# EAGLE design 12 (EAGLE 9.6.2)
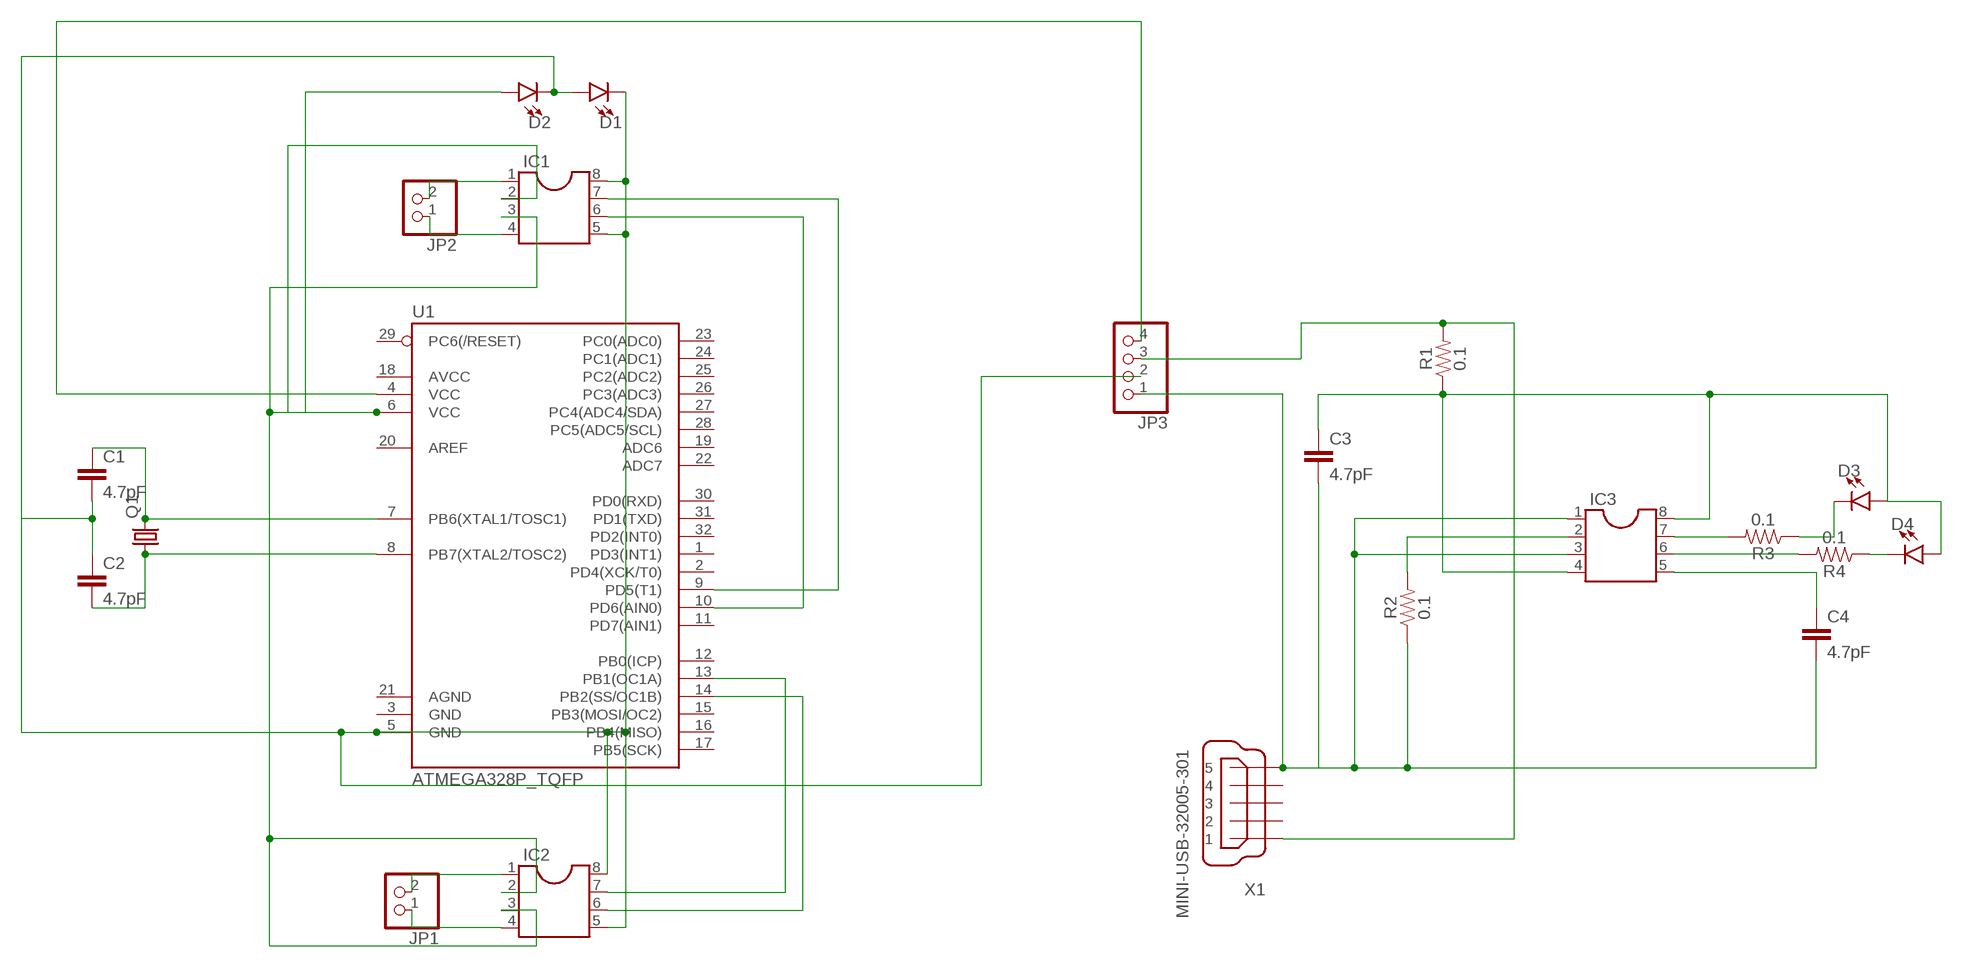
[diagram p0: schematic, sheet 1]

## Parts
C1  4.7pF  4.7PF-0603-50V-5%  [0603]
C2  4.7pF  4.7PF-0603-50V-5%  [0603]
C3  4.7pF  4.7PF-0603-50V-5%  [0603]
C4  4.7pF  4.7PF-0603-50V-5%  [0603]
D1  LED0603  [LED-0603]
D2  LED0603  [LED-0603]
D3  LED0603  [LED-0603]
D4  LED0603  [LED-0603]
IC1  DIL8  [DIL08]
IC2  DIL8  [DIL08]
IC3  DIL8  [DIL08]
JP1  PINHD-1X2  [1X02]
JP2  PINHD-1X2  [1X02]
JP3  PINHD-1X4  [1X04]
Q1  CRYSTALHC49UP  [HC49UP]
R1  0.1  0.1OHM-1210-1/2W-1%  [1210]
R2  0.1  0.1OHM-1210-1/2W-1%  [1210]
R3  0.1  0.1OHM-1210-1/2W-1%  [1210]
R4  0.1  0.1OHM-1210-1/2W-1%  [1210]
U1  ATMEGA328P_TQFP  [TQFP32-08]
X1  MINI-USB-32005-301  [32005-301]

## Nets
N$1: JP3.4 U1.4(VCC)
N$2: D2.A IC1.2 IC1.3 IC2.2 IC2.3 U1.6(VCC)
N$3: IC1.1 JP2.2
N$4: IC1.6 U1.10(PD6(AIN0))
N$5: IC1.7 U1.9(PD5(T1))
N$6: IC2.7 U1.13(PB1(OC1A))
N$7: IC2.6 U1.14(PB2(SS/OC1B))
N$8: C1.1 Q1.2 U1.7(PB6(XTAL1/TOSC1))
N$9: C2.2 Q1.1 U1.8(PB7(XTAL2/TOSC2))
N$10: IC1.4 JP2.1
N$11: IC2.1 JP1.2
N$12: IC2.4 JP1.1
N$13: C3.1 D3.A D4.A IC3.4 IC3.8 R1.1
N$14: IC3.7 R3.2
N$15: IC3.6 R4.2
N$16: D3.C R3.1
N$17: D4.C R4.1
N$18: C4.1 IC3.5
N$19: C1.2 C2.1 D1.A D1.C D2.C IC1.5 IC1.8 IC2.5 IC2.8 JP3.2 U1.5(GND)
N$20: IC3.2 R2.2
N$22: C3.2 C4.2 IC3.1 IC3.3 JP3.1 R2.1 X1.5
N$23: JP3.3 R1.2 X1.1
Unconnected: U1.1(PD3(INT1)) U1.2(PD4(XCK/T0)) U1.3(GND) U1.11(PD7(AIN1)) U1.12(PB0(ICP)) U1.15(PB3(MOSI/OC2)) U1.16(PB4(MISO)) U1.17(PB5(SCK)) U1.18(AVCC) U1.19(ADC6) U1.20(AREF) U1.21(AGND) U1.22(ADC7) U1.23(PC0(ADC0)) U1.24(PC1(ADC1)) U1.25(PC2(ADC2)) U1.26(PC3(ADC3)) U1.27(PC4(ADC4/SDA)) U1.28(PC5(ADC5/SCL)) U1.29(PC6(/RESET)) U1.30(PD0(RXD)) U1.31(PD1(TXD)) U1.32(PD2(INT0)) X1.2 X1.3 X1.4

## Library data of the parts
C1-C4 = SparkFun-Capacitors:4.7PF: 4.7pF ceramic capacitors A capacitor is a passive two-terminal electrical component used to store electrical energy temporarily in an electric field.; PROD_ID: CAP-07880
D1-D4 = SparkFun-LED:LED: LED (Generic) Standard schematic elements and footprints for 5mm, 3mm, 1206, and 0603 sized LEDs. Generic LEDs with no color specified.
IC1-IC3 = ic-package:DIL8: Dual In Line / Socket
JP1 JP2 = pinhead:PINHD-1X2: PIN HEADER
JP3 = pinhead:PINHD-1X4: PIN HEADER
Q1 = crystal:CRYSTAL: CRYSTAL; OC_FARNELL: unknown; OC_NEWARK: unknown
R1-R4 = SparkFun-Resistors:0.1OHM: 0.1Ω resistor A resistor is a passive two-terminal electrical component that implements electrical resistance as a circuit element. Resistors act to reduce current flow, and, at the same time, act to lower voltage levels within circuits. - Wikipedia; PROD_ID: RES-12374
U1 = SparkFun-IC-Microcontroller:ATMEGA328P_TQFP: Popular 328P in QFP Storefront component: ATmega328 - TQFP <https://www.sparkfun.com/products/13448> (COM-13448) Datasheet <http://www.sparkfun.com/datasheets/Components/SMD/ATMega328.pdf> SparkFun Products SparkFun RedBoard - Programmed with Arduino <https://www.sparkfun.com/products/12757> (DEV-12757) Arduino Pro Mini 328 - 5V/16MHz <https://www.sparkfun.com/products/11113> (DEV-11113) Arduino Pro Mini 328 - 3.3V/8MHz <https://www.sparkfun.com/products/11114> (DEV-11114) SparkFun OpenLog <https://www.sparkfun.com/products/13712> (DEV-13712) SparkFun MicroView - OLED Arduino Module <https://www.sparkfun.com/products/12923> (DEV-12923) SparkFun Digital Sandbox <https://www.sparkfun.com/products/12651> (DEV-12651) SparkFun PicoBoard <https://www.sparkfun.com/products/11888> (WIG-11888) Arduino Fio <https://www.sparkfun.com/products/10116> (DEV-10116) LilyPad Arduino 328 Main Board <https://www.sparkfun.com/products/13342> (DEV-13342) SparkFun RedStick <https://www.sparkfun.com/products/13741> (DEV-13741) LilyPad MP3 <https://www.sparkfun.com/products/11013> (DEV-11013) LilyPad Arduino SimpleSnap <https://www.sparkfun.com/products/10941> (DEV-10941) SparkFun Stepoko <https://www.sparkfun.com/products/13899> (ROB-13899) SparkFun Geiger Counter <https://www.sparkfun.com/products/11345> (SEN-11345) SparkFun EL Sequencer <https://www.sparkfun.com/products/12781> (COM-12781) Arduino Pro 328 - 5V/16MHz <https://www.sparkfun.com/products/10915> (DEV-10915) CryptoCape <https://www.sparkfun.com/products/12773> (DEV-12773) SparkFun IR Thermometer Evaluation Board - MLX90614 <https://www.sparkfun.com/products/10740> (SEN-10740) SparkFun RedBot Mainboard <https://www.sparkfun.com/products/12097> (ROB-12097) Arduino Pro 328 - 3.3V/8MHz <https://www.sparkfun.com/products/10914> (DEV-10914) SparkFun Block for Intel® Edison - Arduino <https://www.sparkfun.com/products/13036> (DEV-13036) SparkFun Simon Says - Surface Mount Soldering Kit <https://www.sparkfun.com/products/10935> (KIT-10935) SparkFun 7-Segment Serial Display - Red <https://www.sparkfun.com/products/11441> (COM-11441) SparkFun 7-Segment Serial Display - White <https://www.sparkfun.com/products/11629> (COM-11629) SparkFun 7-Segment Serial Display - Yellow <https://www.sparkfun.com/products/11443> (COM-11443) SparkFun 7-Segment Serial Display - Kelly Green <https://www.sparkfun.com/products/11440> (COM-11440) SparkFun 7-Segment Serial Display - Blue <https://www.sparkfun.com/products/11442> (COM-11442) SparkFun OpenSegment Serial Display - 20mm (Blue) <https://www.sparkfun.com/products/11647> (COM-11647) SparkFun OpenSegment Serial Display - 20mm (Green) <https://www.sparkfun.com/products/11646> (COM-11646) SparkFun OpenSegment Serial Display - 20mm (White) <https://www.sparkfun.com/products/11648> (COM-11648) SparkFun OpenSegment Serial Display - 20mm (Red) <https://www.sparkfun.com/products/11644> (COM-11644) SparkFun OpenSegment Serial Display - 20mm (Yellow) <https://www.sparkfun.com/products/11645> (COM-11645) SparkFun OpenSegment Shield <https://www.sparkfun.com/products/13190> (DEV-13190); PROD_ID: IC-09069
X1 = con-cypressindustries:MINI-USB-: MINI USB-B Conector Source: www.cypressindustries.com; OC_FARNELL: unknown; OC_NEWARK: unknown

## Board
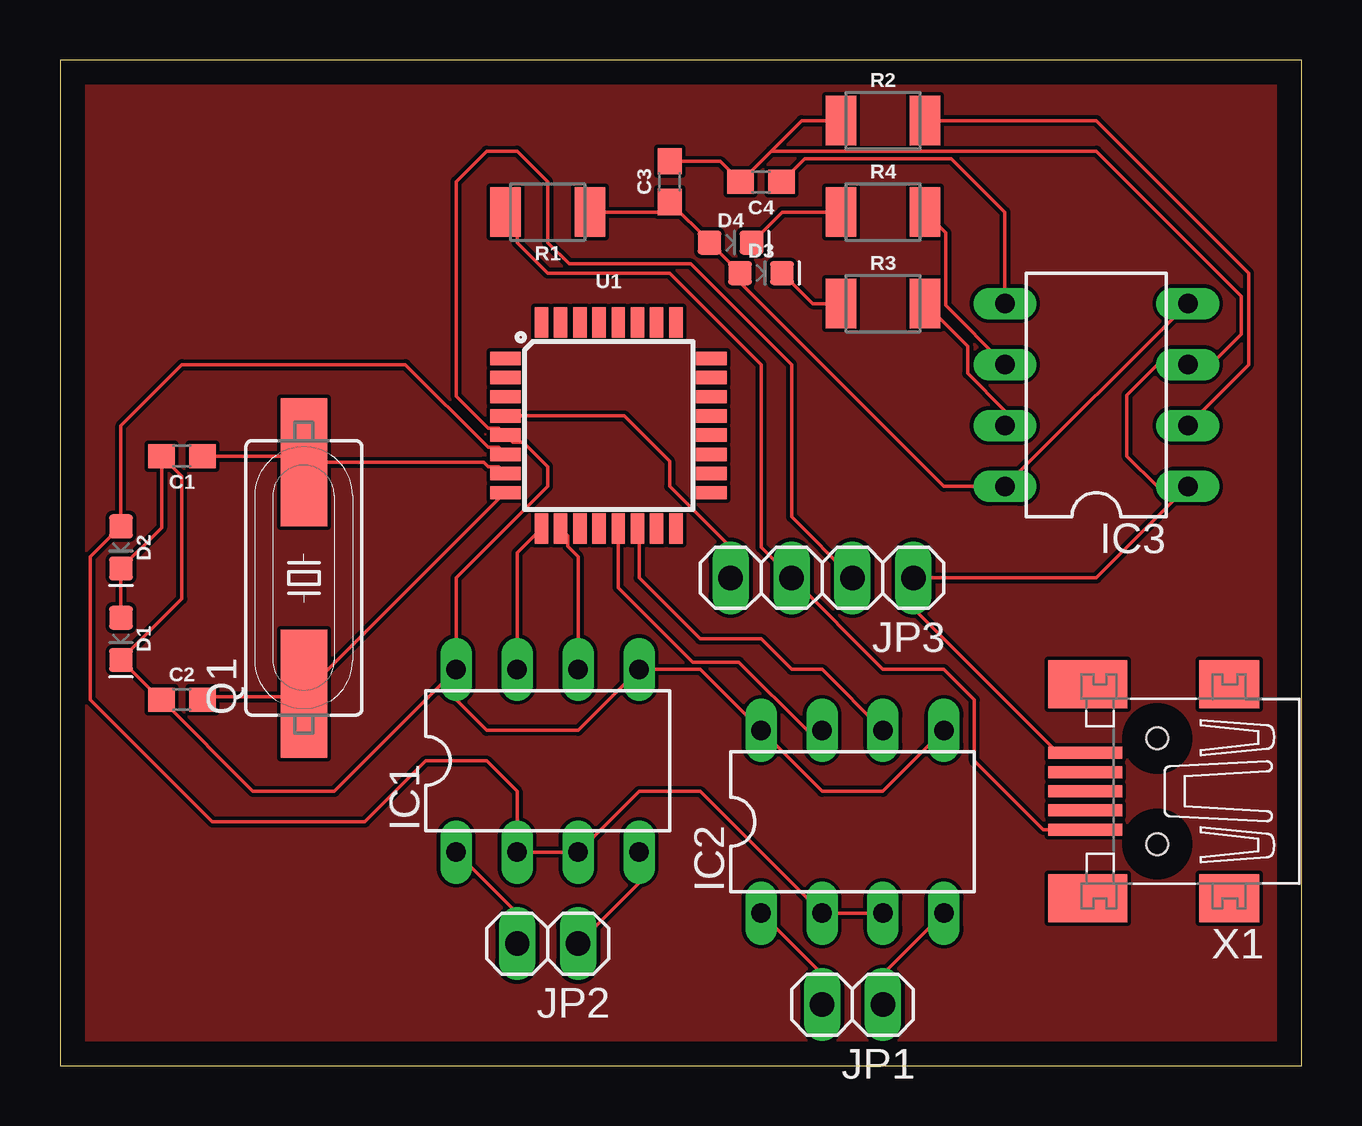
[diagram p1: board, top side]

Size 51.74 x 41.9 mm. Coordinates in mm from the lower left corner, seen from the top.
Outline: 0,0 51.74,0 51.74,41.9 0,41.9 0,0
Copper layers (1*16): Top 0.035mm / dielectric 1.5mm / Bottom 0.035mm
Design rules "default": minimum track width 6mil, minimum drill 0.35mm, track to track 6mil, track to pad 6mil, pad to pad 6mil, via to via 6mil, smd to smd 6mil, copper to edge 40mil, drill to drill 6mil, minimum pad ring 10mil, minimum via ring 8mil, stop-mask expansion 4mil, vias tented up to drill 0mil, thermal gap 10mil

### Footprints (pad centres in the part's own frame; a part is rotated, then mirrored left to right if it is on the bottom)
0603 = smd 1.1 x 1: 1 -0.85,0; 2 0.85,0
LED-0603 = smd 1 x 1: A -0.877,0; C 0.877,0
DIL08 = drill 0.813 long: 1 -3.81,-3.81; 2 -1.27,-3.81; 3 1.27,-3.81; 4 3.81,-3.81; 5 3.81,3.81; 6 1.27,3.81; 7 -1.27,3.81; 8 -3.81,3.81
1X02 = drill 1.016 long: 1 -1.27,0; 2 1.27,0
1X04 = drill 1.016 long: 1 -3.81,0; 2 -1.27,0; 3 1.27,0; 4 3.81,0
HC49UP = smd 5.334 x 1.93: 1 -4.826,0; 2 4.826,0
1210 = smd 1.27 x 2.06: 1 -1.755,0; 2 1.755,0
TQFP32-08 = smd 1.27 x 0.559: 1 -4.293,2.8; 2 -4.293,2; 3 -4.293,1.2; 4 -4.293,0.4; 5 -4.293,-0.4; 6 -4.293,-1.2; 7 -4.293,-2; 8 -4.293,-2.8; 17 4.293,-2.8; 18 4.293,-2; 19 4.293,-1.2; 20 4.293,-0.4; 21 4.293,0.4; 22 4.293,1.2; 23 4.293,2; 24 4.293,2.8 | smd 0.559 x 1.27: 9 -2.8,-4.293; 10 -2,-4.293; 11 -1.2,-4.293; 12 -0.4,-4.293; 13 0.4,-4.293; 14 1.2,-4.293; 15 2,-4.293; 16 2.8,-4.293; 25 2.8,4.293; 26 2,4.293; 27 1.2,4.293; 28 0.4,4.293; 29 -0.4,4.293; 30 -1.2,4.293; 31 -2,4.293; 32 -2.8,4.293
32005-301 = smd 3.1 x 0.5: 1 3,1.6; 2 3,0.8; 3 3,0; 4 3,-0.8; 5 3,-1.6 | smd 2.5 x 2: M1 -3,-4.45; M2 -3,4.45 | smd 3.3 x 2: M3 2.9,4.45; M4 2.9,-4.45 | hole 0.9: 0,2.2; 0,-2.2

### Placement (x,y rotation side)
C1  5.08,25.4 180 top
C2  5.08,15.24 0 top
C3  25.4,36.83 90 top
C4  29.21,36.83 180 top
D1  2.54,17.78 270 top
D2  2.54,21.59 270 top
D3  29.21,33.02 0 top
D4  27.94,34.29 0 top
IC1  20.32,12.7 0 top
IC2  33.02,10.16 0 top
IC3  43.18,27.94 90 top
JP1  33.02,2.54 180 top
JP2  20.32,5.08 180 top
JP3  31.75,20.32 180 top
Q1  10.16,20.32 90 top
R1  20.32,35.56 180 top
R2  34.29,39.37 0 top
R3  34.29,31.75 0 top
R4  34.29,35.56 0 top
U1  22.86,26.67 0 top
X1  45.72,11.43 180 top

### Tracks (layer width: path | path; a pad name or v marks a point on that pad's centre or on a via)
GND
  pour Top: 0,41.91 52.07,41.91 52.07,0 0,0
N$1
  Top 0.152: U1.4 23.52,27.07 25.4,25.18 25.4,24.13 27.94,21.59 JP3.4
N$2
  Top 0.152: D2.A 2.74,22.66 | U1.6 18.27,25.76 17.84,25.76 14.39,29.21 5.08,29.21 2.54,26.67 D2.A | D2.A 1.27,21.2 1.27,15.24 6.35,10.16 12.7,10.16 15.24,12.7 17.78,12.7 19.05,11.43 IC1.2 IC1.3 24.13,11.43 26.67,11.43 IC2.2 IC2.3
N$3
  Top 0.152: IC1.1 19.05,6.35 JP2.2
N$4
  Top 0.152: U1.10 21.15,22.08 21.15,21.65 21.59,21.21 IC1.6
N$5
  Top 0.152: IC1.7 19.05,21.37 U1.9
N$6
  Top 0.152: U1.13 23.26,19.92 26.37,16.82 28.28,16.82 31.13,13.97 IC2.7
N$7
  Top 0.152: U1.14 24.13,22.31 24.13,20.32 26.67,17.78 29.21,17.78 30.48,16.51 31.75,16.51 IC2.6
N$8
  Top 0.152: U1.7 18.27,24.96 17.84,24.96 17.65,25.15 Q1.2 9.91,25.4 C1.1
N$9
  Top 0.152: 10.03,15.37 Q1.1 18.54,23.87 U1.8 | 10.03,15.37 9.91,15.24 | C2.2 6.06,15.37 10.03,15.37
N$10
  Top 0.152: JP2.1 24.13,7.62 IC1.4
N$11
  Top 0.152: IC2.1 31.75,3.81 JP1.2
N$12
  Top 0.152: JP1.1 34.29,3.81 IC2.4
N$13
  Top 0.152: D3.A 28.14,33.22 | 28.14,33.22 D4.A 27.06,34.32 C3.1 24.98,35.56 R1.1 | IC3.4 IC3.8 36.83,24.13 28.14,32.82 28.14,33.22
N$14
  Top 0.152: 36.05,32.23 R3.2 37.82,29.97 37.82,28.84 39.37,27.29 IC3.7
N$15
  Top 0.152: R4.2 36.91,34.7 36.91,31.67 IC3.6
N$16
  Top 0.152: D3.C 31.36,31.75 R3.1
N$17
  Top 0.152: R4.1 30.09,35.56 D4.C
N$18
  Top 0.152: C4.1 31.02,37.8 37.13,37.8 39.37,35.56 IC3.5
N$19
  Top 0.152: D1.C 2.93,16.51 | IC1.8 16.51,20.32 20.32,24.13 20.32,24.96 19.3,25.98 18.86,25.98 U1.5 18.27,26.56 17.84,26.56 16.51,27.89 16.51,36.83 17.78,38.1 19.05,38.1 20.32,36.83 20.32,34.29 21.21,33.4 26.29,33.4 30.48,29.21 30.48,22.86 JP3.2 | IC1.8 16.51,15.24 17.78,13.97 21.59,13.97 IC1.5 26.67,16.51 IC2.8 31.75,11.43 34.29,11.43 IC2.5 | IC1.8 11.43,11.43 8.04,11.43 C2.1 4.2,15.24 D1.C | D1.A D2.C 4.23,22.4 C1.2 5.08,24.55 5.08,19.44 D1.C | D1.C 2.34,17.1
N$20
  Top 0.152: IC3.2 49.53,29.21 49.53,33.02 43.18,39.37 R2.2
N$22
  Top 0.152: C3.2 27.51,37.68 C4.2 | C4.2 30.9,39.37 R2.1 | 35.56,21.59 JP3.1 | JP3.1 35.56,19.05 41.58,13.03 X1.5 | JP3.1 43.18,20.32 IC3.1 45.72,24.13 44.45,25.4 44.45,27.94 45.72,29.21 IC3.3 47.95,29.21 49.22,30.48 49.22,32.05 43.18,38.1 29.63,38.1 C4.2
N$23
  Top 0.152: X1.1 40.97,9.83 38.1,12.7 38.1,15.24 36.83,16.51 34.29,16.51 JP3.3 29.21,21.59 29.21,29.21 25.4,33.02 20.32,33.02 19.05,34.29 19.05,35.56 R1.2